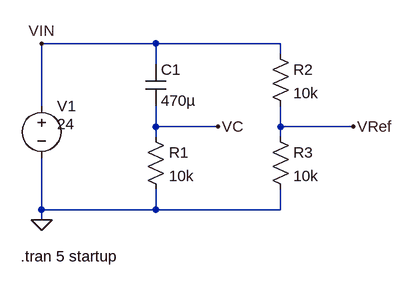
[diagram p0: schematic RTDS Timer.asc]
RTDS Timer.asc, the LTspice schematic file:
Version 4
SHEET 1 880 680
WIRE 224 -32 48 -32
WIRE 416 -32 224 -32
WIRE 416 -16 416 -32
WIRE 224 0 224 -32
WIRE 48 64 48 -32
WIRE 224 96 224 64
WIRE 320 96 224 96
WIRE 416 96 416 64
WIRE 528 96 416 96
WIRE 224 112 224 96
WIRE 416 112 416 96
WIRE 48 224 48 144
WIRE 224 224 224 192
WIRE 224 224 48 224
WIRE 416 224 416 192
WIRE 416 224 224 224
WIRE 48 240 48 224
FLAG 48 240 0
FLAG 48 -32 VIN
FLAG 320 96 VC
FLAG 528 96 VRef
SYMBOL cap 208 0 R0
SYMATTR InstName C1
SYMATTR Value 470µ
SYMBOL res 208 96 R0
SYMATTR InstName R1
SYMATTR Value 10k
SYMBOL voltage 48 48 R0
WINDOW 3 24 44 Left 2
WINDOW 123 0 0 Left 0
WINDOW 39 0 0 Left 0
SYMATTR Value 24
SYMATTR InstName V1
SYMBOL res 400 -32 R0
SYMATTR InstName R2
SYMATTR Value 10k
SYMBOL res 400 96 R0
SYMATTR InstName R3
SYMATTR Value 10k
TEXT 16 296 Left 2 !.tran 5 startup

The netlist it stands for:
* RTDS Timer.asc
C1 VIN VC 470µ
R1 VC 0 10k
V1 VIN 0 24
R2 VIN VRef 10k
R3 VRef 0 10k
.tran 5 startup
.backanno
.end